# Altium schematic sheet FPGA_interface.SchDoc
size A
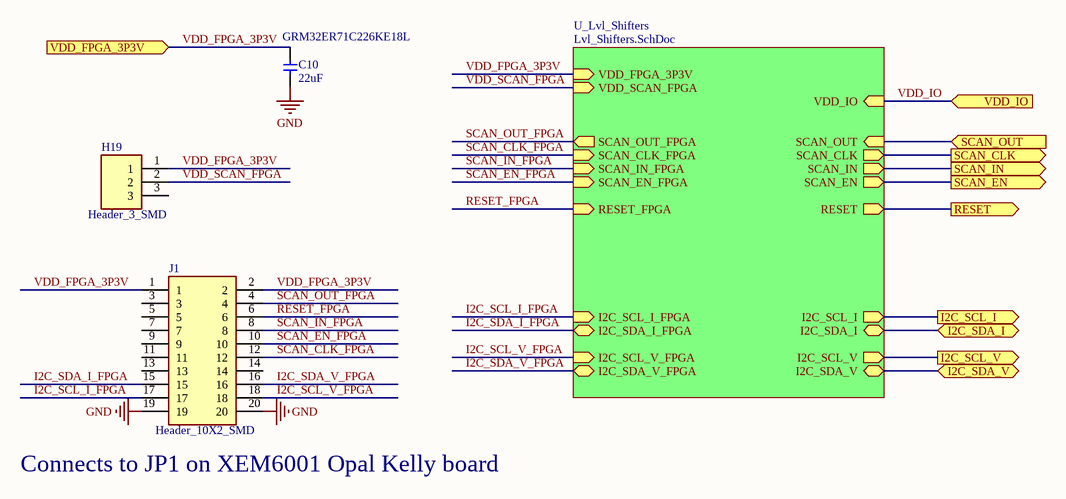
[diagram p0: FPGA_interface.SchDoc]

## Parts
C10  22uF  Supplier Part Number 1: GRM32ER71C226KE18L  [CAPC3225X27N]
H19  Header_3_SMD  [HDR1X3_SMD]
J1  Header_10X2_SMD  [HDR2X10_SMD]

## Sub-sheets
U_Lvl_Shifters = Lvl_Shifters.SchDoc: I2C_SDA_I_FPGA (bidir), I2C_SDA_I (bidir), I2C_SDA_V (bidir), I2C_SDA_V_FPGA (bidir), SCAN_IN_FPGA (in), SCAN_EN_FPGA (in), RESET_FPGA (in), SCAN_OUT_FPGA (out), SCAN_CLK_FPGA (in), VDD_SCAN_FPGA (in), VDD_FPGA_3P3V (in), I2C_SCL_I (out), I2C_SCL_V_FPGA (in), I2C_SCL_V (out), I2C_SCL_I_FPGA (in), VDD_IO (in), SCAN_CLK (out), SCAN_IN (out), RESET (out), SCAN_EN (out), SCAN_OUT (in)

## Ports
I2C_SCL_I (out), I2C_SCL_V (out), I2C_SDA_I (bidir), I2C_SDA_V (bidir), RESET (out), SCAN_CLK (out), SCAN_EN (out), SCAN_IN (out), SCAN_OUT (in), VDD_FPGA_3P3V (in), VDD_IO (in)

## Nets
GND: C10.2 J1.19 J1.20
I2C_SCL_I: port I2C_SCL_I, sheet U_Lvl_Shifters/I2C_SCL_I
I2C_SCL_I_FPGA: J1.17 ; sheet U_Lvl_Shifters/I2C_SCL_I_FPGA
I2C_SCL_V: port I2C_SCL_V, sheet U_Lvl_Shifters/I2C_SCL_V
I2C_SCL_V_FPGA: J1.18 ; sheet U_Lvl_Shifters/I2C_SCL_V_FPGA
I2C_SDA_I: port I2C_SDA_I, sheet U_Lvl_Shifters/I2C_SDA_I
I2C_SDA_I_FPGA: J1.15 ; sheet U_Lvl_Shifters/I2C_SDA_I_FPGA
I2C_SDA_V: port I2C_SDA_V, sheet U_Lvl_Shifters/I2C_SDA_V
I2C_SDA_V_FPGA: J1.16 ; sheet U_Lvl_Shifters/I2C_SDA_V_FPGA
RESET: port RESET, sheet U_Lvl_Shifters/RESET
RESET_FPGA: J1.6 ; sheet U_Lvl_Shifters/RESET_FPGA
SCAN_CLK: port SCAN_CLK, sheet U_Lvl_Shifters/SCAN_CLK
SCAN_CLK_FPGA: J1.12 ; sheet U_Lvl_Shifters/SCAN_CLK_FPGA
SCAN_EN: port SCAN_EN, sheet U_Lvl_Shifters/SCAN_EN
SCAN_EN_FPGA: J1.10 ; sheet U_Lvl_Shifters/SCAN_EN_FPGA
SCAN_IN: port SCAN_IN, sheet U_Lvl_Shifters/SCAN_IN
SCAN_IN_FPGA: J1.8 ; sheet U_Lvl_Shifters/SCAN_IN_FPGA
SCAN_OUT: port SCAN_OUT, sheet U_Lvl_Shifters/SCAN_OUT
SCAN_OUT_FPGA: J1.4 ; sheet U_Lvl_Shifters/SCAN_OUT_FPGA
VDD_FPGA_3P3V: C10.1 H19.1 J1.1 J1.2 ; port VDD_FPGA_3P3V, sheet U_Lvl_Shifters/VDD_FPGA_3P3V
VDD_IO: port VDD_IO, sheet U_Lvl_Shifters/VDD_IO
VDD_SCAN_FPGA: H19.2 ; sheet U_Lvl_Shifters/VDD_SCAN_FPGA

Not connected (* = marked no-connect by the designer): H19 3; J1 3 5 7 9 11 13 14

## Notes on the sheet
- (near J1) Connects to JP1 on XEM6001 Opal Kelly board

## Library data of the parts
C10 = cap 22uF: CAP CER 22uF 10% 16V X7R 1210; Manufacturer: Murata; Manufacturer ID: GRM32ER71C226KE18L; Digikey ID: 490-4524-1-ND; Value: 22uF; Package: 1210; Supplier 1: Arrow
H19 = Header_3_SMD: Connector Header Vertical, SMD, 3 position 0.100" (2.54mm); Manufacturer_Name: SAMTEC; Manufacturer_Part_Number: TSM-103-01-S-SV-P-TR; Datasheet Link: http://suddendocs.samtec.com/prints/tsm-1xx-xx-xxx-sv-xx-xxx-xx-mkt.pdf; Height: 11.17mm; Arrow Part Number: TSM-103-01-S-SV-P-TR; Arrow Price/Stock: https://www.arrow.com/en/products/tsm-103-01-s-sv-p-tr/samtec; Mouser Part Number: 200-TSM10301SSVPTR; Mouser Price/Stock: https://www.mouser.co.uk/ProductDetail/Samtec/TSM-103-01-S-SV-P-TR?qs=FESYatJ8odJI6Ns4akqicQ%3D%3D; Supplier 1: Newark; Supplier 2: Digi-Key; Supplier Part Number 1: 80K8300; Supplier Part Number 2: SAM13283CT-ND
J1 = Header_10X2_SMD: Connector Header Vertical Dual Row, SMD, 20 position 0.100" (2.54mm); Manufacturer_Name: SAMTEC; Manufacturer_Part_Number: TSM-110-01-L-DV-P-TR; Datasheet Link: http://suddendocs.samtec.com/prints/tsm-1xx-xx-xxx-xx-x-xxx-x-mkt.pdf; Height: 9.9mm; Arrow Part Number: TSM-110-01-L-DV-P-TR; Arrow Price/Stock: https://www.arrow.com/en/products/tsm-110-01-l-dv-p-tr/samtec; Mouser Part Number: 200-TSM11001LDVPTR; Mouser Price/Stock: https://www.mouser.co.uk/ProductDetail/Samtec/TSM-110-01-L-DV-P-TR?qs=0lQeLiL1qyblXKkNLjNUWw%3D%3D; Supplier 1: Digi-Key; Supplier Part Number 1: SAM10819-ND